# EAGLE schematic EPAPER133_V2 (EAGLE 9.7.0)
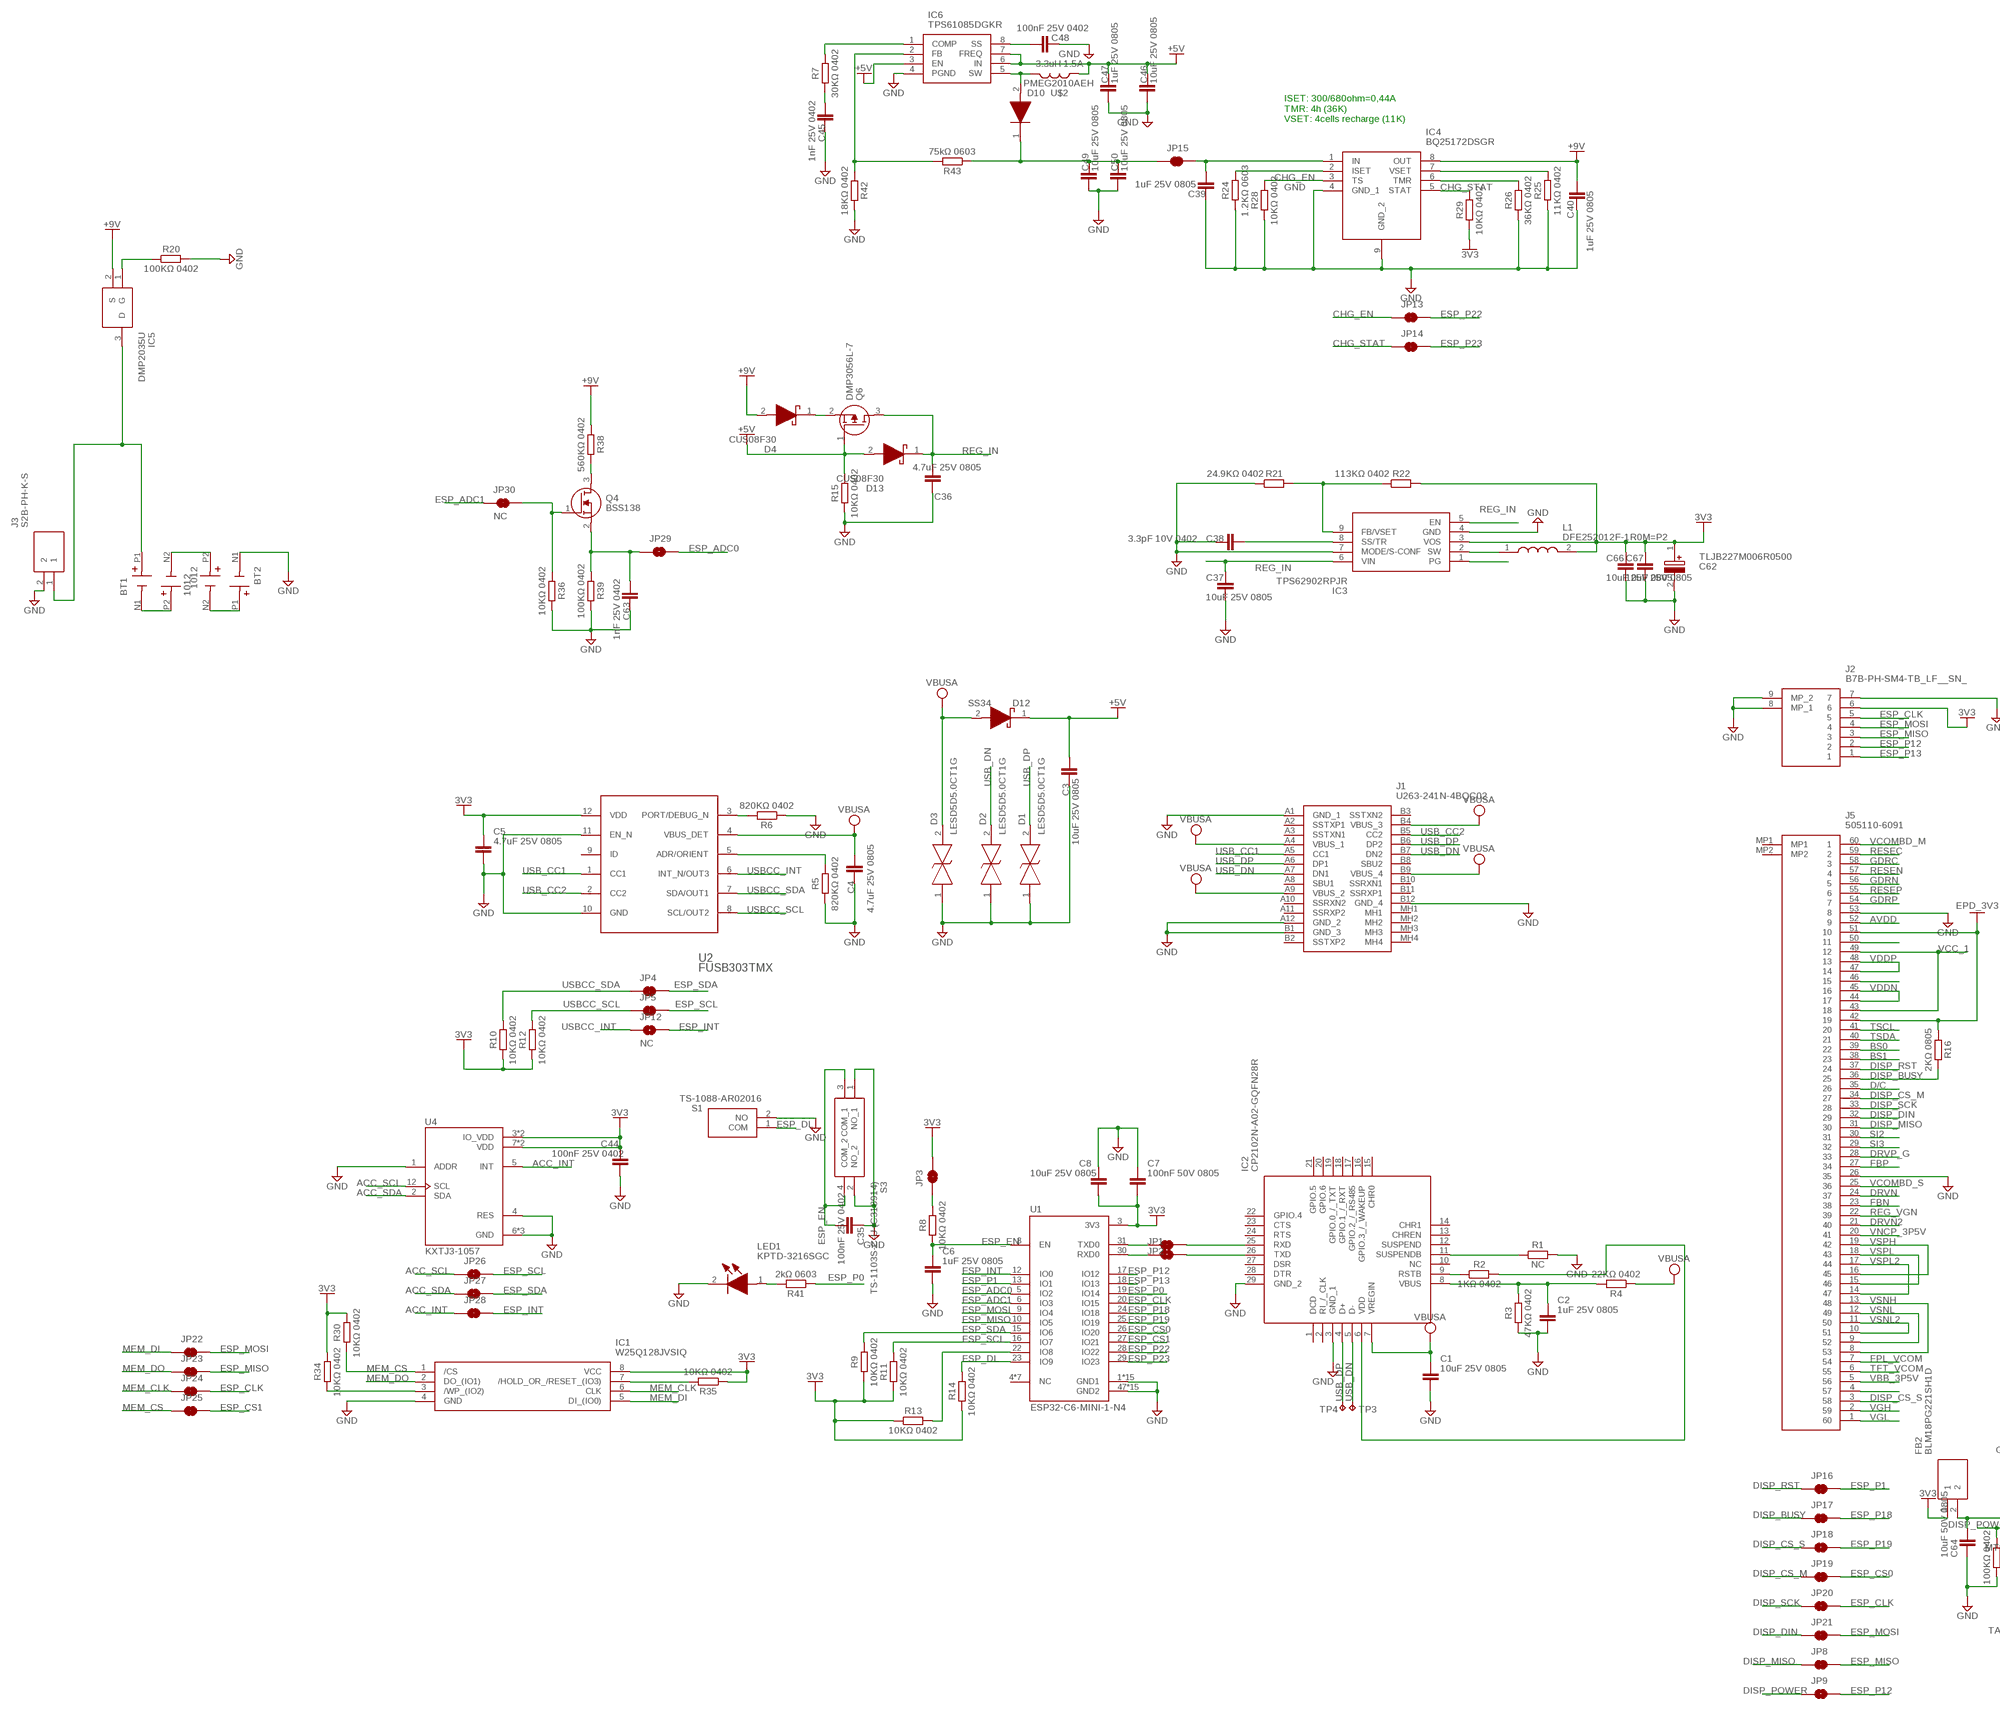
[diagram p0: schematic, sheet 1, part 1 of 2]
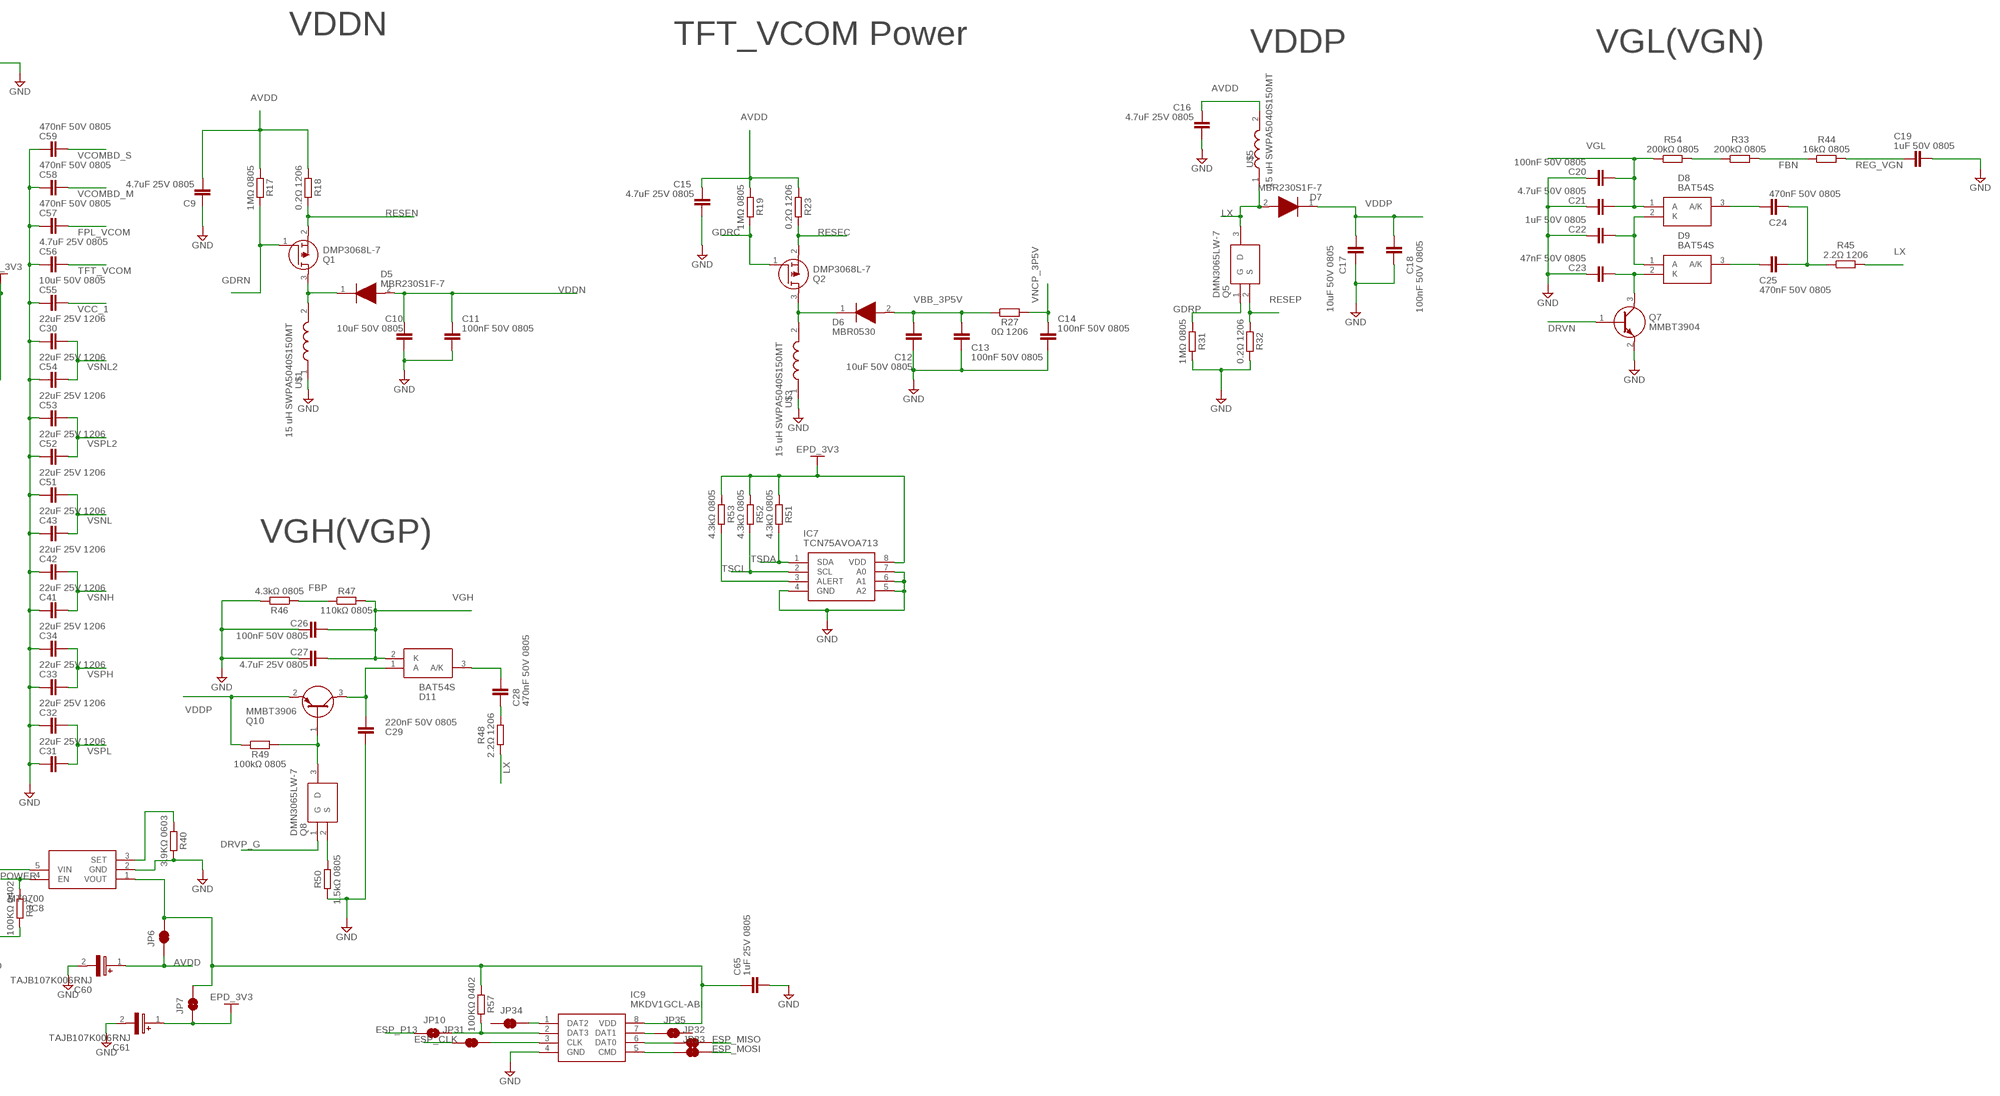
[diagram p1: schematic, sheet 1, part 2 of 2]

## Parts
BT1  1012  [BAT_1012]
BT2  1012  [BAT_1012]
C1  10uF 25V 0805  C_CHIP-0805(2012-METRIC)  [CAPC2012X110]
C2  1uF 25V 0805  C_CHIP-0805(2012-METRIC)  [CAPC2012X110]
C3  10uF 25V 0805  C_CHIP-0805(2012-METRIC)  [CAPC2012X110]
C4  4.7uF 25V 0805  C_CHIP-0805(2012-METRIC)  [CAPC2012X110]
C5  4.7uF 25V 0805  C_CHIP-0805(2012-METRIC)  [CAPC2012X110]
C6  1uF 25V 0805  C_CHIP-0805(2012-METRIC)  [CAPC2012X110]
C7  100nF 50V 0805  C_CHIP-0805(2012-METRIC)  [CAPC2012X110]
C8  10uF 25V 0805  C_CHIP-0805(2012-METRIC)  [CAPC2012X110]
C9  4.7uF 25V 0805  C_CHIP-0805(2012-METRIC)  [CAPC2012X110]
C10  10uF 50V 0805  C_CHIP-0805(2012-METRIC)  [CAPC2012X110]
C11  100nF 50V 0805  C_CHIP-0805(2012-METRIC)  [CAPC2012X110]
C12  10uF 50V 0805  C_CHIP-0805(2012-METRIC)  [CAPC2012X110]
C13  100nF 50V 0805  C_CHIP-0805(2012-METRIC)  [CAPC2012X110]
C14  100nF 50V 0805  C_CHIP-0805(2012-METRIC)  [CAPC2012X110]
C15  4.7uF 25V 0805  C_CHIP-0805(2012-METRIC)  [CAPC2012X110]
C16  4.7uF 25V 0805  C_CHIP-0805(2012-METRIC)  [CAPC2012X110]
C17  10uF 50V 0805  C_CHIP-0805(2012-METRIC)  [CAPC2012X110]
C18  100nF 50V 0805  C_CHIP-0805(2012-METRIC)  [CAPC2012X110]
C19  1uF 50V 0805  C_CHIP-0805(2012-METRIC)  [CAPC2012X110]
C20  100nF 50V 0805  C_CHIP-0805(2012-METRIC)  [CAPC2012X110]
C21  4.7uF 50V 0805  C_CHIP-0805(2012-METRIC)  [CAPC2012X110]
C22  1uF 50V 0805  C_CHIP-0805(2012-METRIC)  [CAPC2012X110]
C23  47nF 50V 0805  C_CHIP-0805(2012-METRIC)  [CAPC2012X110]
C24  470nF 50V 0805  C_CHIP-0805(2012-METRIC)  [CAPC2012X110]
C25  470nF 50V 0805  C_CHIP-0805(2012-METRIC)  [CAPC2012X110]
C26  100nF 50V 0805  C_CHIP-0805(2012-METRIC)  [CAPC2012X110]
C27  4.7uF 25V 0805  C_CHIP-0805(2012-METRIC)  [CAPC2012X110]
C28  470nF 50V 0805  C_CHIP-0805(2012-METRIC)  [CAPC2012X110]
C29  220nF 50V 0805  C_CHIP-0805(2012-METRIC)  [CAPC2012X110]
C30  22uF 25V 1206  C_CHIP-1206(3216-METRIC)  [CAPC3216X135]
C31  22uF 25V 1206  C_CHIP-1206(3216-METRIC)  [CAPC3216X135]
C32  22uF 25V 1206  C_CHIP-1206(3216-METRIC)  [CAPC3216X135]
C33  22uF 25V 1206  C_CHIP-1206(3216-METRIC)  [CAPC3216X135]
C34  22uF 25V 1206  C_CHIP-1206(3216-METRIC)  [CAPC3216X135]
C35  100nF 25V 0402  C_CHIP-0402(1005-METRIC)  [CAPC1005X60]
C36  4.7uF 25V 0805  C_CHIP-0805(2012-METRIC)  [CAPC2012X110]
C37  10uF 25V 0805  C_CHIP-0805(2012-METRIC)  [CAPC2012X110]
C38  3.3pF 10V 0402  C_CHIP-0402(1005-METRIC)  [CAPC1005X60]
C39  1uF 25V 0805  C_CHIP-0805(2012-METRIC)  [CAPC2012X110]
C40  1uF 25V 0805  C_CHIP-0805(2012-METRIC)  [CAPC2012X110]
C41  22uF 25V 1206  C_CHIP-1206(3216-METRIC)  [CAPC3216X135]
C42  22uF 25V 1206  C_CHIP-1206(3216-METRIC)  [CAPC3216X135]
C43  22uF 25V 1206  C_CHIP-1206(3216-METRIC)  [CAPC3216X135]
C44  100nF 25V 0402  C_CHIP-0402(1005-METRIC)  [CAPC1005X60]
C45  1nF 25V 0402  C_CHIP-0402(1005-METRIC)  [CAPC1005X60]
C46  10uF 25V 0805  C_CHIP-0805(2012-METRIC)  [CAPC2012X110]
C47  1uF 25V 0805  C_CHIP-0805(2012-METRIC)  [CAPC2012X110]
C48  100nF 25V 0402  C_CHIP-0402(1005-METRIC)  [CAPC1005X60]
C49  10uF 25V 0805  C_CHIP-0805(2012-METRIC)  [CAPC2012X110]
C50  10uF 25V 0805  C_CHIP-0805(2012-METRIC)  [CAPC2012X110]
C51  22uF 25V 1206  C_CHIP-1206(3216-METRIC)  [CAPC3216X135]
C52  22uF 25V 1206  C_CHIP-1206(3216-METRIC)  [CAPC3216X135]
C53  22uF 25V 1206  C_CHIP-1206(3216-METRIC)  [CAPC3216X135]
C54  22uF 25V 1206  C_CHIP-1206(3216-METRIC)  [CAPC3216X135]
C55  10uF 50V 0805  C_CHIP-0805(2012-METRIC)  [CAPC2012X110]
C56  4.7uF 25V 0805  C_CHIP-0805(2012-METRIC)  [CAPC2012X110]
C57  470nF 50V 0805  C_CHIP-0805(2012-METRIC)  [CAPC2012X110]
C58  470nF 50V 0805  C_CHIP-0805(2012-METRIC)  [CAPC2012X110]
C59  470nF 50V 0805  C_CHIP-0805(2012-METRIC)  [CAPC2012X110]
C60  TAJB107K006RNJ  [CAPPM3528X210N]
C61  TAJB107K006RNJ  [CAPPM3528X210N]
C62  TLJB227M006R0500  [CAPPM3528X210N]
C63  1nF 25V 0402  C_CHIP-0402(1005-METRIC)  [CAPC1005X60]
C64  10uF 50V 0805  C_CHIP-0805(2012-METRIC)  [CAPC2012X110]
C65  1uF 25V 0805  C_CHIP-0805(2012-METRIC)  [CAPC2012X110]
C66  10uF 25V 0805  C_CHIP-0805(2012-METRIC)  [CAPC2012X110]
C67  10uF 25V 0805  C_CHIP-0805(2012-METRIC)  [CAPC2012X110]
D1  LESD5D5.0CT1G  [LESD5D50CT1G]
D2  LESD5D5.0CT1G  [LESD5D50CT1G]
D3  LESD5D5.0CT1G  [LESD5D50CT1G]
D4  CUS08F30  [CUS357H3F]
D5  MBR230S1F-7  [SODFL3518X115N]
D6  MBR0530  [SOD3716X135N]
D7  MBR230S1F-7  [SODFL3518X115N]
D8  BAT54S  [SOT95P240X120-3N]
D9  BAT54S  [SOT95P240X120-3N]
D10  PMEG2010AEH  [SODFL3516X120N]
D11  BAT54S  [SOT95P240X120-3N]
D12  SS34  [DIOM5327X244N]
D13  CUS08F30  [CUS357H3F]
FB2  BLM18PG221SH1D  [BLM18SP221SN1B]
IC1  W25Q128JVSIQ  [SOIC127P790X216-8N]
IC2  CP2102N-A02-GQFN28R  [QFN50P500X500X80-29N]
IC3  TPS62902RPJR  [TPS62902RPJR]
IC4  BQ25172DSGR  [SON50P200X200X80-9N]
IC5  DMP2035U  [SOT96P240X115-3N]
IC6  TPS61085DGKR  [SOP65P490X110-8N]
IC7  TCN75AVOA713  [SOIC127P600X175-8N]
IC8  MT9700  [SOT95P280X135-5N]
IC9  MKDV1GCL-AB  [SON127P800X600X80-8N]
J1  U263-241N-4BQC02  [U263241N4BQC02]
J2  B7B-PH-SM4-TB_LF__SN_  [B7BPHSM4TBLFSN]
J3  S2B-PH-K-S  [S2BPHKS]
J5  505110-6091  [5051106091]
JP1  NC  JUMPER-SMT_2_NC_TRACE_NO-SILK  [SMT-JUMPER_2_NC_TRACE_NO-SILK]
JP2  NC  JUMPER-SMT_2_NC_TRACE_NO-SILK  [SMT-JUMPER_2_NC_TRACE_NO-SILK]
JP3  NC  JUMPER-SMT_2_NC_TRACE_NO-SILK  [SMT-JUMPER_2_NC_TRACE_NO-SILK]
JP4  NC  JUMPER-SMT_2_NC_TRACE_NO-SILK  [SMT-JUMPER_2_NC_TRACE_NO-SILK]
JP5  NC  JUMPER-SMT_2_NC_TRACE_NO-SILK  [SMT-JUMPER_2_NC_TRACE_NO-SILK]
JP6  NC  JUMPER-SMT_2_NC_TRACE_NO-SILK  [SMT-JUMPER_2_NC_TRACE_NO-SILK]
JP7  NC  JUMPER-SMT_2_NC_TRACE_NO-SILK  [SMT-JUMPER_2_NC_TRACE_NO-SILK]
JP8  NC  JUMPER-SMT_2_NC_TRACE_NO-SILK  [SMT-JUMPER_2_NC_TRACE_NO-SILK]
JP9  NC  JUMPER-SMT_2_NC_TRACE_NO-SILK  [SMT-JUMPER_2_NC_TRACE_NO-SILK]
JP10  NC  JUMPER-SMT_2_NC_TRACE_NO-SILK  [SMT-JUMPER_2_NC_TRACE_NO-SILK]
JP12  NC  JUMPER-SMT_2_NO_NO-SILK  [SMT-JUMPER_2_NO_NO-SILK]
JP13  NC  JUMPER-SMT_2_NC_TRACE_NO-SILK  [SMT-JUMPER_2_NC_TRACE_NO-SILK]
JP14  NC  JUMPER-SMT_2_NC_TRACE_NO-SILK  [SMT-JUMPER_2_NC_TRACE_NO-SILK]
JP15  NC  JUMPER-SMT_2_NC_TRACE_NO-SILK  [SMT-JUMPER_2_NC_TRACE_NO-SILK]
JP16  NC  JUMPER-SMT_2_NC_TRACE_NO-SILK  [SMT-JUMPER_2_NC_TRACE_NO-SILK]
JP17  NC  JUMPER-SMT_2_NC_TRACE_NO-SILK  [SMT-JUMPER_2_NC_TRACE_NO-SILK]
JP18  NC  JUMPER-SMT_2_NC_TRACE_NO-SILK  [SMT-JUMPER_2_NC_TRACE_NO-SILK]
JP19  NC  JUMPER-SMT_2_NC_TRACE_NO-SILK  [SMT-JUMPER_2_NC_TRACE_NO-SILK]
JP20  NC  JUMPER-SMT_2_NC_TRACE_NO-SILK  [SMT-JUMPER_2_NC_TRACE_NO-SILK]
JP21  NC  JUMPER-SMT_2_NC_TRACE_NO-SILK  [SMT-JUMPER_2_NC_TRACE_NO-SILK]
JP22  NC  JUMPER-SMT_2_NC_TRACE_NO-SILK  [SMT-JUMPER_2_NC_TRACE_NO-SILK]
JP23  NC  JUMPER-SMT_2_NC_TRACE_NO-SILK  [SMT-JUMPER_2_NC_TRACE_NO-SILK]
JP24  NC  JUMPER-SMT_2_NC_TRACE_NO-SILK  [SMT-JUMPER_2_NC_TRACE_NO-SILK]
JP25  NC  JUMPER-SMT_2_NC_TRACE_NO-SILK  [SMT-JUMPER_2_NC_TRACE_NO-SILK]
JP26  NC  JUMPER-SMT_2_NC_TRACE_NO-SILK  [SMT-JUMPER_2_NC_TRACE_NO-SILK]
JP27  NC  JUMPER-SMT_2_NC_TRACE_NO-SILK  [SMT-JUMPER_2_NC_TRACE_NO-SILK]
JP28  NC  JUMPER-SMT_2_NC_TRACE_NO-SILK  [SMT-JUMPER_2_NC_TRACE_NO-SILK]
JP29  NC  JUMPER-SMT_2_NC_TRACE_NO-SILK  [SMT-JUMPER_2_NC_TRACE_NO-SILK]
JP30  NC  JUMPER-SMT_2_NC_TRACE_NO-SILK  [SMT-JUMPER_2_NC_TRACE_NO-SILK]
JP31  NC  JUMPER-SMT_2_NC_TRACE_NO-SILK  [SMT-JUMPER_2_NC_TRACE_NO-SILK]
JP32  NC  JUMPER-SMT_2_NC_TRACE_NO-SILK  [SMT-JUMPER_2_NC_TRACE_NO-SILK]
JP33  NC  JUMPER-SMT_2_NC_TRACE_NO-SILK  [SMT-JUMPER_2_NC_TRACE_NO-SILK]
JP34  NC  JUMPER-SMT_2_NC_TRACE_NO-SILK  [SMT-JUMPER_2_NC_TRACE_NO-SILK]
JP35  NC  JUMPER-SMT_2_NC_TRACE_NO-SILK  [SMT-JUMPER_2_NC_TRACE_NO-SILK]
L1  DFE252012F-1R0M=P2  [DFE2HCAH1R0MJ0L]
LED1  KPTD-3216SGC  [KPTD3216SGC]
Q1  DMP3068L-7  [SOT96P240X115-3N]
Q2  DMP3068L-7  [SOT96P240X115-3N]
Q4  BSS138  [SOT95P240X120-3N]
Q5  DMN3065LW-7  [SOT65P210X110-3N]
Q6  DMP3056L-7  [SOT96P240X110-3N]
Q7  MMBT3904  [SOT95P230X110-3N]
Q8  DMN3065LW-7  [SOT65P210X110-3N]
Q10  MMBT3906  [SOT95P230X110-3N]
R1  NC  R_CHIP-0402(1005-METRIC)  [RESC1005X40]
R2  1KΩ 0402  R_CHIP-0402(1005-METRIC)  [RESC1005X40]
R3  47KΩ 0402  R_CHIP-0402(1005-METRIC)  [RESC1005X40]
R4  22KΩ 0402  R_CHIP-0402(1005-METRIC)  [RESC1005X40]
R5  820KΩ 0402  R_CHIP-0402(1005-METRIC)  [RESC1005X40]
R6  820KΩ 0402  R_CHIP-0402(1005-METRIC)  [RESC1005X40]
R7  30KΩ 0402  R_CHIP-0402(1005-METRIC)  [RESC1005X40]
R8  10KΩ 0402  R_CHIP-0402(1005-METRIC)  [RESC1005X40]
R9  10KΩ 0402  R_CHIP-0402(1005-METRIC)  [RESC1005X40]
R10  10KΩ 0402  R_CHIP-0402(1005-METRIC)  [RESC1005X40]
R11  10KΩ 0402  R_CHIP-0402(1005-METRIC)  [RESC1005X40]
R12  10KΩ 0402  R_CHIP-0402(1005-METRIC)  [RESC1005X40]
R13  10KΩ 0402  R_CHIP-0402(1005-METRIC)  [RESC1005X40]
R14  10KΩ 0402  R_CHIP-0402(1005-METRIC)  [RESC1005X40]
R15  10KΩ 0402  R_CHIP-0402(1005-METRIC)  [RESC1005X40]
R16  2KΩ 0805  R_CHIP-0805(2012-METRIC)  [RESC2012X65]
R17  1MΩ 0805  R_CHIP-0805(2012-METRIC)  [RESC2012X65]
R18  0.2Ω 1206  R_CHIP-1206(3216-METRIC)  [RESC3216X70]
R19  1MΩ 0805  R_CHIP-0805(2012-METRIC)  [RESC2012X65]
R20  100KΩ 0402  R_CHIP-0402(1005-METRIC)  [RESC1005X40]
R21  24.9KΩ 0402  R_CHIP-0402(1005-METRIC)  [RESC1005X40]
R22  113KΩ 0402  R_CHIP-0402(1005-METRIC)  [RESC1005X40]
R23  0.2Ω 1206  R_CHIP-1206(3216-METRIC)  [RESC3216X70]
R24  1.2KΩ 0603  R_CHIP-0603(1608-METRIC)  [RESC1608X60]
R25  11KΩ 0402  R_CHIP-0402(1005-METRIC)  [RESC1005X40]
R26  36KΩ 0402  R_CHIP-0402(1005-METRIC)  [RESC1005X40]
R27  0Ω 1206  R_CHIP-1206(3216-METRIC)  [RESC3216X70]
R28  10KΩ 0402  R_CHIP-0402(1005-METRIC)  [RESC1005X40]
R29  10KΩ 0402  R_CHIP-0402(1005-METRIC)  [RESC1005X40]
R30  10KΩ 0402  R_CHIP-0402(1005-METRIC)  [RESC1005X40]
R31  1MΩ 0805  R_CHIP-0805(2012-METRIC)  [RESC2012X65]
R32  0.2Ω 1206  R_CHIP-1206(3216-METRIC)  [RESC3216X70]
R33  200kΩ 0805  R_CHIP-0805(2012-METRIC)  [RESC2012X65]
R34  10KΩ 0402  R_CHIP-0402(1005-METRIC)  [RESC1005X40]
R35  10KΩ 0402  R_CHIP-0402(1005-METRIC)  [RESC1005X40]
R36  10KΩ 0402  R_CHIP-0402(1005-METRIC)  [RESC1005X40]
R37  100KΩ 0402  R_CHIP-0402(1005-METRIC)  [RESC1005X40]
R38  560KΩ 0402  R_CHIP-0402(1005-METRIC)  [RESC1005X40]
R39  100KΩ 0402  R_CHIP-0402(1005-METRIC)  [RESC1005X40]
R40  3.9KΩ 0603  R_CHIP-0603(1608-METRIC)  [RESC1608X60]
R41  2kΩ 0603  R_CHIP-0603(1608-METRIC)  [RESC1608X60]
R42  18KΩ 0402  R_CHIP-0402(1005-METRIC)  [RESC1005X40]
R43  75kΩ 0603  R_CHIP-0603(1608-METRIC)  [RESC1608X60]
R44  16kΩ 0805  R_CHIP-0805(2012-METRIC)  [RESC2012X65]
R45  2.2Ω 1206  R_CHIP-1206(3216-METRIC)  [RESC3216X70]
R46  4.3kΩ 0805  R_CHIP-0805(2012-METRIC)  [RESC2012X65]
R47  110kΩ 0805  R_CHIP-0805(2012-METRIC)  [RESC2012X65]
R48  2.2Ω 1206  R_CHIP-1206(3216-METRIC)  [RESC3216X70]
R49  100kΩ 0805  R_CHIP-0805(2012-METRIC)  [RESC2012X65]
R50  1.5kΩ 0805  R_CHIP-0805(2012-METRIC)  [RESC2012X65]
R51  4.3kΩ 0805  R_CHIP-0805(2012-METRIC)  [RESC2012X65]
R52  4.3kΩ 0805  R_CHIP-0805(2012-METRIC)  [RESC2012X65]
R53  4.3kΩ 0805  R_CHIP-0805(2012-METRIC)  [RESC2012X65]
R54  200kΩ 0805  R_CHIP-0805(2012-METRIC)  [RESC2012X65]
R57  100KΩ 0402  R_CHIP-0402(1005-METRIC)  [RESC1005X40]
S1  TS-1088-AR02016  [TS1088AR02016]
S3  TS-1103S-C-U (C318914)  TS-1103S-C-U  [TS1103SCU]
TP3  TPB1,27  [B1,27]
TP4  TPB1,27  [B1,27]
U1  ESP32-C6-MINI-1-N4  [XCVR_ESP32-C6-MINI-1-N4]
U2  FUSB303TMX  [X2QFN12]
U4  KXTJ3-1057  [KIONIX_KXTJ3-1057]
U$1  15 uH SWPA5040S150MT  SWPA5040S150MT  [INDPM5050X400N]
U$2  3.3uH 1.5A  CUSTOMINDUCTORSSL0420-3R3M  [SL0420-3R3M]
U$3  15 uH SWPA5040S150MT  SWPA5040S150MT  [INDPM5050X400N]
U$5  15 uH SWPA5040S150MT  SWPA5040S150MT  [INDPM5050X400N]

## Nets
3V3: C5.1 C7.2 C8.2 C44.1 C62.1(+) C66.2 C67.2 FB2.1 IC1.8(VCC) IC3.3(VOS) J2.6 JP3.2 L1.2 R9.1 R10.1 R11.1 R12.1 R13.1 R14.1 R22.2 R29.1 R30.2 R34.2 R35.1 U1.3(3V3) U2.12(VDD) U4.3(IO_VDD) U4.7(VDD) U4.10(VDD) U4.11(IO_VDD)
5V0: C1.1 C4.1 D3.2 D12.2(A) IC2.7(VREGIN) J1.A4(VBUS_1) J1.A9(VBUS_2) J1.B4(VBUS_3) J1.B9(VBUS_4) R4.1 U2.4(VBUS_DET) ; supply symbol labelled VBUSA
+5V: C3.1 C46.1 C47.1 D12.1(K) D13.2(A) IC6.3(EN) IC6.6(IN) IC6.7(FREQ) Q6.1(G) R15.2 U$2.1
+9V: C40.2 D4.2(A) IC4.8(OUT) IC5.2(S) R38.1
ACC_INT: JP28.1 U4.5(INT)
ACC_SCL: JP26.1 U4.12(SCL)
ACC_SDA: JP27.1 U4.2(SDA)
AVDD: C9.1 C15.1 C16.1 C60.1(+) J5.52 JP6.1 R17.1 R18.1 R19.1 R23.1 U$5.2
BS0: J5.39
BS1: J5.38
CHG_EN: IC4.3(TS) JP13.1 R28.2
CHG_STAT: IC4.5(STAT) JP14.1 R29.2
D/C: J5.35
DISP_BUSY: J5.36 JP17.1 R16.2
DISP_CS_M: J5.34 JP19.1
DISP_CS_S: J5.3 JP18.1
DISP_DIN: J5.32 JP21.1
DISP_MISO: J5.31 JP8.1
DISP_POWER: IC8.4(EN) JP9.1 R37.1
DISP_RST: J5.37 JP16.1
DISP_SCK: J5.33 JP20.1
DRVN: J5.24 Q7.1(B)
DRVN2: J5.21
DRVP_G: J5.28 Q8.1(G)
ESP_ADC0: JP29.2 U1.5(IO2)
ESP_ADC1: JP30.1 U1.6(IO3)
ESP_CLK: J2.5 JP20.2 JP24.2 JP31.1 U1.20(IO15)
ESP_CS0: JP19.2 U1.26(IO20)
ESP_CS1: JP25.2 U1.27(IO21)
ESP_DL: R14.2 S1.1(COM) U1.23(IO9)
ESP_EN: C6.1 C35.1 R8.1 S3.3(COM_1) S3.4(COM_2) U1.8(EN)
ESP_INT: JP12.2 JP28.2 U1.12(IO0)
ESP_MISO: J2.3 JP8.2 JP23.2 JP32.2 U1.10(IO5)
ESP_MOSI: J2.4 JP21.2 JP22.2 JP33.2 U1.9(IO4)
ESP_P0: R41.1 U1.19(IO14)
ESP_P1: JP16.2 U1.13(IO1)
ESP_P12: J2.2 JP9.2 U1.17(IO12)
ESP_P13: J2.1 JP10.1 U1.18(IO13)
ESP_P18: JP17.2 U1.24(IO18)
ESP_P19: JP18.2 U1.25(IO19)
ESP_P22: JP13.2 U1.28(IO22)
ESP_P23: JP14.2 U1.29(IO23)
ESP_SCL: JP5.2 JP26.2 R11.2 U1.16(IO7)
ESP_SDA: JP4.2 JP27.2 R9.2 U1.15(IO6)
FBN: J5.23 R33.2 R44.1
FBP: J5.27 R46.1 R47.1
FPL_VCOM: C57.2 J5.7
GDRC: J5.58 Q2.1(G) R19.2
GDRN: J5.56 Q1.1(G) R17.2
GDRP: J5.54 Q5.1(G) R31.1
GND: BT2.N1(NEG1) C1.2 C2.2 C3.2 C4.2 C5.2 C6.2 C7.1 C8.1 C9.2 C10.2 C11.2 C12.2 C13.2 C14.2 C15.2 C16.2 C17.2 C18.2 C19.2 C20.1 C21.1 C22.1 C23.1 C26.1 C27.1 C29.1 C30.1 C31.1 C32.1 C33.1 C34.1 C35.2 C36.1 C37.1 C38.2 C39.1 C40.1 C41.1 C42.1 C43.1 C44.2 C45.2 C46.2 C47.2 C48.2 C49.2 C50.2 C51.1 C52.1 C53.1 C54.1 C55.1 C56.1 C57.1 C58.1 C59.1 C60.2(-) C61.2(-) C62.2(-) C63.2 C64.1 C65.2 C66.1 C67.1 D1.1 D2.1 D3.1 IC1.4(GND) IC2.3(GND_1) IC2.29(GND_2) IC3.4(GND) IC3.7(MODE/S-CONF) IC4.4(GND_1) IC4.9(GND_2) IC6.4(PGND) IC7.4(GND) IC7.5(A2) IC7.6(A1) IC7.7(A0) IC8.2(GND) IC9.4(GND) J1.A1(GND_1) J1.A12(GND_2) J1.B1(GND_3) J1.B12(GND_4) J2.7 J2.8(MP_1) J2.9(MP_2) J3.2 J5.26 J5.53 LED1.2(K) Q7.2(E) R1.2 R3.1 R5.1 R6.1 R15.1 R20.2 R21.1 R24.1 R25.1 R26.1 R28.1 R31.2 R32.2 R36.2 R37.2 R39.2 R40.2 R42.2 R46.2 R50.1 S1.2(NO) S3.1(NO_1) S3.2(NO_2) U1.1(GND1) U1.2(GND1) U1.11(GND1) U1.14(GND1) U1.36(GND1) U1.37(GND1) U1.38(GND1) U1.39(GND1) U1.40(GND1) U1.41(GND1) U1.42(GND1) U1.43(GND1) U1.44(GND1) U1.45(GND1) U1.46(GND1) U1.47(GND2) U1.48(GND2) U1.49_1(GND2) U1.49_2(GND2) U1.49_3(GND2) U1.49_4(GND2) U1.49_5(GND2) U1.49_6(GND2) U1.49_7(GND2) U1.49_8(GND2) U1.49_9(GND2) U1.50(GND2) U1.51(GND2) U1.52(GND2) U1.53(GND2) U2.10(GND) U2.11(EN_N) U4.1(ADDR) U4.4(RES) U4.6(GND) U4.8(GND) U4.9(GND) U$1.1 U$3.1
LX: D7.2(A) Q5.3(D) R45.2 R48.1 U$5.1
MEM_CLK: IC1.6(CLK) JP24.1
MEM_CS: IC1.1(/CS) JP25.1 R30.1
MEM_DI: IC1.5(DI_(IO0)) JP22.1
MEM_DO: IC1.2(DO_(IO1)) JP23.1
N$1: JP1.1 U1.31(TXD0)
N$2: JP2.1 U1.30(RXD0)
N$3: IC2.25(RXD) JP1.2
N$4: IC2.26(TXD) JP2.2
N$5: IC2.9(RSTB) R2.1
N$6: IC2.11(SUSPENDB) R1.1
N$7: C2.1 IC2.8(VBUS) R3.2 R4.2
N$8: C22.2 D8.2(K) D9.1(A)
N$9: D5.1(K) Q1.3(D) U$1.2
N$10: R5.2 U2.5(ADR/ORIENT)
N$11: IC2.6(VDD) R2.2
N$12: R6.2 U2.3(PORT/DEBUG_N)
N$14: JP3.1 R8.2
N$15: C64.2 FB2.2 IC8.5(VIN)
N$16: R13.2 U1.22(IO8)
N$17: IC9.2(DAT3) JP10.2 R57.2
N$18: D6.1(K) Q2.3(D) U$3.2
N$19: C63.1 JP29.1 Q4.2(S) R39.1
N$20: C28.1 R48.2
N$21: C24.2 C25.2 R45.1
N$22: C25.1 D9.3(A/K)
N$23: C24.1 D8.3(A/K)
N$24: J5.50
N$25: C23.2 D9.2(K) Q7.3(C)
N$26: IC7.3(ALERT) R53.2
N$27: C29.2 D11.1(A) Q10.3(C)
N$28: J5.46
N$29: C28.2 D11.3(A/K)
N$30: Q8.2(S) R50.2
N$31: Q8.3(D) Q10.1(B) R49.2
N$32: Q4.3(D) R38.2
N$33: IC8.3(SET) R40.1
N$34: C65.1 IC8.1(VOUT) IC9.8(VDD) JP6.2 JP7.2 R57.1
N$35: IC9.3(CLK) JP31.2
N$36: IC9.1(DAT2) JP34.2
N$37: IC9.6(DAT0) JP32.1
N$38: D4.1(K) Q6.2(S)
N$39: IC3.2(SW) L1.1
N$40: IC3.9(FB/VSET) R21.2 R22.1
N$41: IC5.1(G) R20.1
N$42: IC9.5(CMD) JP33.1
N$43: BT1.P1(POS1) IC5.3(D) J3.1
N$44: IC9.7(DAT1) JP35.1
N$45: IC3.1(PG)
N$46: IC4.2(ISET) R24.2
N$47: IC4.7(VSET) R25.2
N$48: IC4.6(TMR) R26.2
N$49: JP30.2 Q4.1(G) R36.1
N$50: C49.1 C50.1 D10.1(K) JP15.1 R43.1
N$51: BT1.N1(NEG1) BT1.P2(POS2)
N$52: BT1.N2(NEG2) BT2.P2(POS2)
N$53: BT2.N2(NEG2) BT2.P1(POS1)
N$54: C38.1 IC3.8(SS/TR)
N$55: R33.1 R54.2
N$56: C39.2 IC4.1(IN) JP15.2
N$58: IC1.3(/WP_(IO2)) R34.1
N$62: LED1.1(A) R41.2
N$65: IC1.7(/HOLD_OR_/RESET_(IO3)) R35.2
N$67: IC6.1(COMP) R7.2
N$68: C45.1 R7.1
N$69: D10.2(A) IC6.5(SW) U$2.2
N$70: C48.1 IC6.8(SS)
N$71: IC6.2(FB) R42.1 R43.2
N$94: J5.4
REG_IN: C36.2 C37.2 D13.1(K) IC3.5(EN) IC3.6(VIN) Q6.3(D)
REG_VGN: C19.1 J5.22 R44.2
RESEC: J5.59 Q2.2(S) R23.2
RESEN: J5.57 Q1.2(S) R18.2
RESEP: J5.55 Q5.2(S) R32.1
SI2: J5.30
SI3: J5.29
TFT_VCOM: C56.2 J5.6
TSCL: IC7.2(SCL) J5.41 R52.2
TSDA: IC7.1(SDA) J5.40 R51.2
USB_CC1: J1.A5(CC1) U2.1(CC1)
USB_CC2: J1.B5(CC2) U2.2(CC2)
USB_DN: D2.2 IC2.5(D-) J1.A7(DN1) J1.B7(DN2) TP3.TP
USB_DP: D1.2 IC2.4(D+) J1.A6(DP1) J1.B6(DP2) TP4.TP
USBCC_INT: JP12.1 U2.6(INT_N/OUT3)
USBCC_SCL: JP5.1 R12.2 U2.8(SCL/OUT2)
USBCC_SDA: JP4.1 R10.2 U2.7(SDA/OUT1)
VBB_3P5V: C12.1 C13.1 D6.2(A) J5.5 R27.1
VCC: C61.1(+) IC7.8(VDD) J5.42 J5.51 JP7.1 R16.1 R51.1 R52.1 R53.1 ; supply symbol labelled EPD_3V3
VCC_1: C55.2 J5.43 J5.49
VCOMBD_M: C58.2 J5.60
VCOMBD_S: C59.2 J5.25
VDDN: C10.1 C11.1 D5.2(A) J5.44 J5.45
VDDP: C17.1 C18.1 D7.1(K) J5.47 J5.48 Q10.2(E) R49.1
VGH: C26.2 C27.2 D11.2(K) J5.2 R47.2
VGL: C20.2 C21.2 D8.1(A) J5.1 R54.1
VNCP_3P5V: C14.1 J5.20 R27.2
VSNH: C41.2 C42.2 J5.8 J5.13
VSNL: C43.2 C51.2 J5.9 J5.12
VSNL2: C30.2 C54.2 J5.10 J5.11
VSPH: C33.2 C34.2 J5.16 J5.19
VSPL: C31.2 C32.2 J5.15 J5.18
VSPL2: C52.2 C53.2 J5.14 J5.17
Unconnected: IC2.1(DCD) IC2.2(RI_/_CLK) IC2.10(NC) IC2.12(SUSPEND) IC2.13(CHREN) IC2.14(CHR1) IC2.15(CHR0) IC2.16(GPIO.3_/_WAKEUP) IC2.17(GPIO.2_/_RS485) IC2.18(GPIO.1_/_RXT) IC2.19(GPIO.0_/_TXT) IC2.20(GPIO.6) IC2.21(GPIO.5) IC2.22(GPIO.4) IC2.23(CTS) IC2.24(RTS) IC2.27(DSR) IC2.28(DTR) J1.A2(SSTXP1) J1.A3(SSTXN1) J1.A8(SBU1) J1.A10(SSRXN2) J1.A11(SSRXP2) J1.B2(SSTXP2) J1.B3(SSTXN2) J1.B8(SBU2) J1.B10(SSRXN1) J1.B11(SSRXP1) J1.MH1 J1.MH2 J1.MH3 J1.MH4 J5.MP1 J5.MP2 JP34.1 JP35.2 U1.4(NC) U1.7(NC) U1.21(NC) U1.32(NC) U1.33(NC) U1.34(NC) U1.35(NC) U2.9(ID)

## Notes on the sheet
- ISET: 300/680ohm=0,44A
  TMR: 4h (36K)
  VSET: 4cells recharge (11K)
- VDDP | VGL(VGN)
- VDDN | TFT_VCOM Power
- VGH(VGP)

## Library data of the parts
BT1 BT2 = 1012:1012
C1-C59 C63-C67 = Capacitor:C: Capacitor - Generic
C60 C61 = TAJB107K006RNJ:TAJB107K006RNJ: AVX 100 Source: Datasheet <http://datasheets.avx.com/TAJ.pdf>
C62 = TLJB227M006R0500:TLJB227M006R0500: Tantalum Capacitors - Solid SMD 6.3V 220uF 20% ESR=500 Source: Datasheet <https://www.mouser.fr/datasheet/2/40/TLJ-3169755.pdf>
D1-D3 = LESD5D5.0CT1G:LESD5D5.0CT1G: Transient Voltage Suppressors for ESD Protection Source: Datasheet
D4 D13 = CUS08F30:CUS08F30: 30 V/0.8 A Schottky Barrier Diode, SOD-323(USC) Source: Datasheet <https://toshiba.semicon-storage.com/info/docget.jsp?did=9019&prodName=CUS08F30>
D5 D7 = MBR230S1F-7:MBR230S1F-7: Diodes Inc MBR230S1F-7, SMT Schottky Barrier Diode, 30V 2A, 2-Pin SOD123F Source: Datasheet <https://www.diodes.com/assets/Datasheets/MBR230S1F.pdf>
D6 = MBR0530:MBR0530: Compact Surface Mount Package with The Same Footprint as Mini-melf; Schottky Rectifier, 0.5A, 30V in SOD-123 Package Source: Datasheet <https://www.onsemi.com/pub/Collateral/MBR0530-D.PDF>
D8 D9 D11 = BAT54S:BAT54S: Obsolete - Schottky Barrier Diode Source: Datasheet <https://www.onsemi.com/download/data-sheet/pdf/BAT54S-D.pdf>
D10 = PMEG2010AEH:PMEG2010AEH: Diode Schottky 20V 1A,PMEG2010AEH NXP PMEG2010AEH Schottky Diode, 1A, 20V, 2-Pin SOD123F Source: Datasheet <https://datasheet.datasheetarchive.com/originals/distributors/Datasheets-SFU1/DSASFU100012661.pdf>
D12 = SS34:SS34: SMD Schottky Diode Source: Datasheet <https://datasheet.lcsc.com/szlcsc/2003051532_KEXIN-SS34_C489140.pdf>
FB2 = BLM18PG221SH1D:BLM18PG221SH1D: Murata Power Solutions Ferrite Bead (Chip Bead), 1.6 x 0.8 x 0.8mm (1608), 220 impedance at 100 MHz Source: Datasheet <http://www.murata.com/~/media/webrenewal/support/library/catalog/products/emc/emifil/c31e.ashx?la=en-gb>
IC1 = W25Q128JVSIQ:W25Q128JVSIQ: 128M-bit Serial Flash Memory with uniform 4KB sectors and Dual/Quad SPI Source: Datasheet <https://www.winbond.com/hq/search-resource-file.jsp?partNo=W25Q128JVSIQ&type=datasheet>
IC2 = CP2102N-A02-GQFN28R:CP2102N-A02-GQFN28R: USB Interface IC USB to UART bridge - QFN28 Source: Datasheet <https://www.silabs.com/documents/public/data-sheets/cp2102n-datasheet.pdf>
IC3 = TPS62902RPJR:TPS62902RPJR: Switching Voltage Regulators 3-V to 17-V, 2-A, high-efficiency and low IQ buck converter 1.5-mm 2-mm QFN package Source: Datasheet <https://www.ti.com/lit/ds/symlink/tps62902.pdf?ts=1620315805655&ref_url=https%3A%2F%2Fpt.mouser.com%2F>
IC4 = BQ25172DSGR:BQ25172DSGR: Battery Management 0.8-A, one- to six-cell NiMH stand-alone linear charger in a QFN package Source: Datasheet <https://www.arrow.com/en/products/bq25172dsgr/texas-instruments?region=nac>
IC5 = DMP2035U:DMP2035U: MOSFET, P CH, ESD,-20V,-3.6A, SOT23 Source: Datasheet <https://www.diodes.com/assets/Datasheets/DMP2035U.pdf>
IC6 = TPS61085DGKR:TPS61085DGKR: 18.5V, 2A, 650kHz / 1.2MHz Step-Up DC-DC Converter w/ Forced PWM Mode Source: Datasheet <http://www.ti.com/general/docs/suppproductinfo.tsp?distId=10&gotoUrl=http://www.ti.com/lit/gpn/tps61085>
IC7 = TCN75AVOA713:TCN75AVOA713: Board Mount Temperature Sensors 2-Wire SER Temp Sens/Ther Mon Source: Datasheet <https://datasheet.datasheetarchive.com/originals/distributors/Datasheets-18/DSA-357922.pdf>
IC8 = MT9700:MT9700: ic Source: Datasheet <https://datasheet.lcsc.com/szlcsc/1809291208_XI-AN-Aerosemi-Tech-MT9700_C89855.pdf>
IC9 = MKDV1GCL-AB:MKDV1GCL-AB: Embedded SD Flash Source: Datasheet <https://datasheet.lcsc.com/lcsc/2110081830_MK-MKDV1GCL-AB_C2686055.pdf>
J1 = U263-241N-4BQC02:U263-241N-4BQC02: 3.1TYPE-C connector female 24P upright Source: Datasheet <http://www.helloxkb.com/public/images/pdf/U263-24XN-4BQC02.pdf>
J2 = B7B-PH-SM4-TB_LF__SN_:B7B-PH-SM4-TB_LF__SN_: JST PH Series 2 mm Pitch 7 Position SMT Single Row Top Entry Shrouded Header Source: Datasheet <https://www.jst-mfg.com/product/pdf/eng/ePH.pdf>
J3 = S2B-PH-K-S:S2B-PH-K-S: CONN HEADER R/A 2POS 2MM Source: Datasheet <https://media.digikey.com/pdf/Data Sheets/JST PDFs/PH Series.pdf>
J5 = 505110-6091:505110-6091: Easy-On FFC/FPC Connector, 0.50mm Pitch, FD19 Series, Right-Angle, Bottom Contact, 1.90mm Height, Circuits, Gold over Nickel Plating Source: Datasheet <https://componentsearchengine.com/Datasheets/2/505110-6091.pdf>
JP1-JP10 JP13-JP35 = SparkFun-Jumpers:JUMPER-SMT_2_NC_TRACE: Normally closed trace jumper This jumper has a trace between two pads so it's normally closed (NC). Use a razor knife to open the connection. For best results follow the IPC guidelines for cutting traces: Cutout at least 0.063 mm (0.005 in). Remove all loose material to clean up the cut area. Seal the cut with an approved epoxy. Reapply solder to reclose the connection.
JP12 = SparkFun-Jumpers:JUMPER-SMT_2_NO: Normally open jumper This jumper has two pads in close proximity to each other. Apply solder to close the connection. Round pads are easier to solder for beginners, but are a lot larger. SparkFun Product that uses the round pads: SparkFun EL Sequencer <https://www.sparkfun.com/products/12781>
L1 = DFE252012F-1R0M=P2:DFE252012F-1R0M=P2: DFE252012F Series Inductor 1.0uH +/-20% 1008 (2520) Source: Datasheet <https://search.murata.co.jp/Ceramy/image/img/P02/J(E)TE243A-0017.pdf>
LED1 = KPTD-3216SGC:KPTD-3216SGC: LED super bright green 568nm;105mW;water clear;3.2x1.6mm;SMT;reel Source: Datasheet <http://uk.rs-online.com/web/p/products/4664024>
Q1 Q2 = DMP3068L-7:DMP3068L-7: MOSFET 30V P-Ch Enh Mode 72mOhm -10V -3.9A Source: Datasheet <https://www.diodes.com//assets/Datasheets/DMP3068L.pdf>
Q4 = BSS138:BSS138: Compact industry standard SOT-23 surface mount package.; 0.22 A, 50 V. RDS(ON) = 3.5 @ VGS = 10 V. RDS(ON) = 6.0 @ VGS = 4.5 V; Rugged and Reliable.; High density cell design for extremely low RDS(ON). Source: Datasheet <https://www.onsemi.com/pub/Collateral/BSS138-D.PDF>
Q5 Q8 = DMN3065LW-7:DMN3065LW-7: Diodes Inc DMN3065LW-7 N-channel MOSFET Transistor, 4 A, 30 V, 3-Pin SOT-323 Source: Datasheet <https://www.diodes.com//assets/Datasheets/DMN3065LW.pdf>
Q6 = DMP3056L-7:DMP3056L-7: MOSFET 30V P-Ch Enh Mode 50mOhm -10Vgs -4.3A Source: Datasheet <https://www.diodes.com//assets/Datasheets/DMP3056L.pdf>
Q7 = MMBT3904:MMBT3904: 200 MA, NPN, SI, SMALL SIGNAL TRANSISTOR Source: Datasheet <https://datasheet.pas.partquest.com/images/VipMasterIC/IC/PIRS/PIRSS12856/PIRSS12856-1.pdf?hkey=61A2E4C270F0397D049F8F05BD4F1054>
Q10 = MMBT3906:MMBT3906: TRANSISTOR,BJT,PNP,40V V(BR)CEO,200MA I(C),SOT-23 65 +150 C ,100 mA,40 V Source: Datasheet <https://datasheet.pas.partquest.com/images/VipMasterIC/IC/PIRS/PIRSS12749/PIRSS12749-1.pdf?hkey=61A2E4C270F0397D049F8F05BD4F1054>
R1-R54 R57 = Resistor:R: Resistor Fixed - Generic
S1 = TS-1088-AR02016:TS-1088-AR02016: Tact Switch Source: Datasheet <https://www.xunpudianzi.com/uploads/pdf/TS-1088-ARXXX.pdf>
S3 = TS-1103S-C-U:TS-1103S-C-U: tact switch 12x12X14 patch cylindrical black knob 260GF stainless steel shrapnel Source: Datasheet <http://www.helloxkb.com/public/images/pdf/TS-1103S-X-X.pdf>
TP3 TP4 = testpad:TP: Test pad
U1 = ESP32-C6-MINI-1-N4:ESP32-C6-MINI-1-N4: Check availability <https://pricing.snapeda.com/parts/ESP32-C6-MINI-1-N4/Espressif%20Systems/view-part?ref=eda>
U2 = FUSB303TMX:FUSB303TMX: Check availability <https://pricing.snapeda.com/parts/FUSB303TMX/ON%20Semiconductor/view-part?ref=eda>
U4 = KXTJ3-1057:KXTJ3-1057: Check availability <https://pricing.snapeda.com/parts/KXTJ3-1057/Kionix%20Inc./view-part?ref=eda>
U$1 U$3 U$5 = SWPA5040S1R0NT:SWPA5040S150MT: 1uH +/-30% 4.9A 16m SMD,5.0x5.0x4.0mm Power Inductors RoHS Source: Datasheet
U$2 = BCIHP0420SC-100M:CUSTOMINDUCTORS